# EAGLE schematic circuit_schematic (EAGLE 9.7.0)
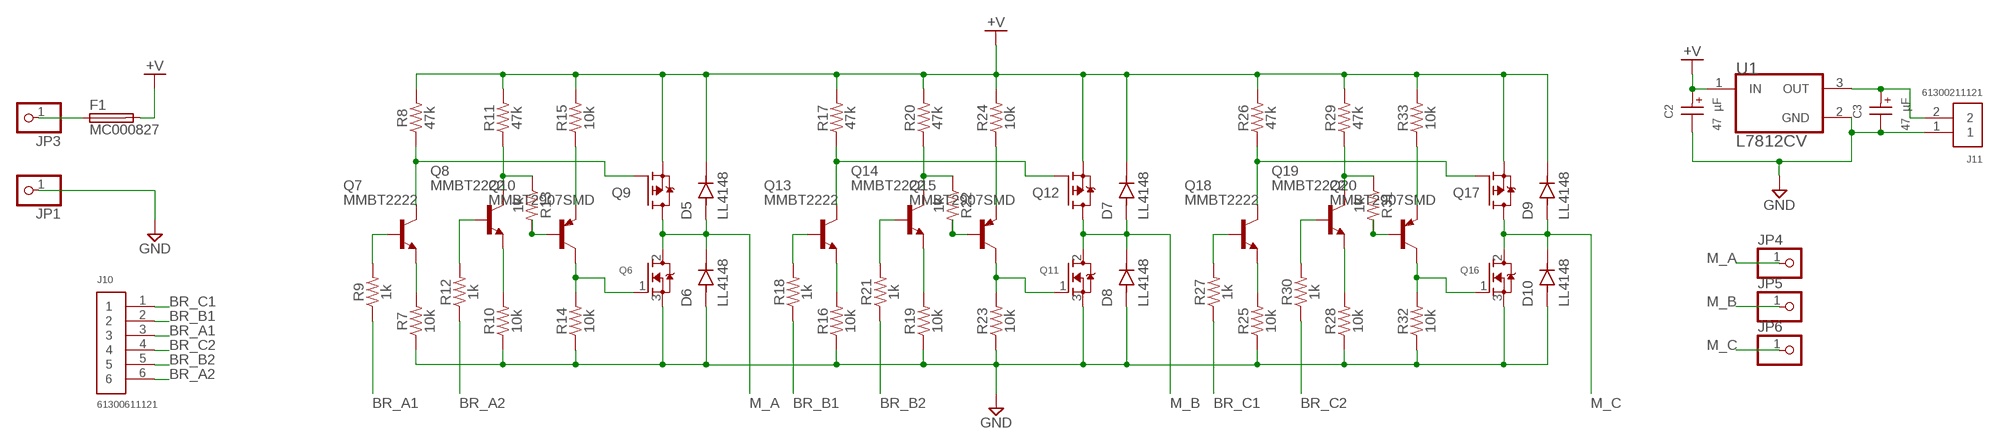
[diagram p0: schematic, sheet 1]

## Parts
C2  47 µF  WCAP-ATET_5X11_860130272001  [WCAP-ATET_5X11(DXL)]
C3  47 µF  WCAP-ATET_5X11_860130272001  [WCAP-ATET_5X11(DXL)]
D5  LL4148  [DIO_LL4148]
D6  LL4148  [DIO_LL4148]
D7  LL4148  [DIO_LL4148]
D8  LL4148  [DIO_LL4148]
D9  LL4148  [DIO_LL4148]
D10  LL4148  [DIO_LL4148]
F1  MC000827  [MC000827]
J10  61300611121  [61300611121]
J11  61300211121  [61300211121]
JP1  PINHD-1X1  [1X01]
JP3  PINHD-1X1  [1X01]
JP4  PINHD-1X1  [1X01]
JP5  PINHD-1X1  [1X01]
JP6  PINHD-1X1  [1X01]
Q6  MOSFET-NGDS_TO220V  [TO220V]
Q7  MMBT2222  [SOT23-BEC]
Q8  MMBT2222  [SOT23-BEC]
Q9  MOSFET-PGDS_TO220V  [TO220V]
Q10  MMBT2907SMD  [SOT23-BEC]
Q11  MOSFET-NGDS_TO220V  [TO220V]
Q12  MOSFET-PGDS_TO220V  [TO220V]
Q13  MMBT2222  [SOT23-BEC]
Q14  MMBT2222  [SOT23-BEC]
Q15  MMBT2907SMD  [SOT23-BEC]
Q16  MOSFET-NGDS_TO220V  [TO220V]
Q17  MOSFET-PGDS_TO220V  [TO220V]
Q18  MMBT2222  [SOT23-BEC]
Q19  MMBT2222  [SOT23-BEC]
Q20  MMBT2907SMD  [SOT23-BEC]
R7  10k  RESISTOR1206  [1206]
R8  47k  RESISTOR1206  [1206]
R9  1k  RESISTOR1206  [1206]
R10  10k  RESISTOR1206  [1206]
R11  47k  RESISTOR1206  [1206]
R12  1k  RESISTOR1206  [1206]
R13  1k  RESISTOR1206  [1206]
R14  10k  RESISTOR1206  [1206]
R15  10k  RESISTOR1206  [1206]
R16  10k  RESISTOR1206  [1206]
R17  47k  RESISTOR1206  [1206]
R18  1k  RESISTOR1206  [1206]
R19  10k  RESISTOR1206  [1206]
R20  47k  RESISTOR1206  [1206]
R21  1k  RESISTOR1206  [1206]
R22  1k  RESISTOR1206  [1206]
R23  10k  RESISTOR1206  [1206]
R24  10k  RESISTOR1206  [1206]
R25  10k  RESISTOR1206  [1206]
R26  47k  RESISTOR1206  [1206]
R27  1k  RESISTOR1206  [1206]
R28  10k  RESISTOR1206  [1206]
R29  47k  RESISTOR1206  [1206]
R30  1k  RESISTOR1206  [1206]
R31  1k  RESISTOR1206  [1206]
R32  10k  RESISTOR1206  [1206]
R33  10k  RESISTOR1206  [1206]
U1  L7812CV  [TO-220-3]

## Nets
+V: C2.1(+) D5.C D7.C D9.C F1.P$2 Q9.3(S) Q12.3(S) Q17.3(S) R8.2 R11.2 R15.2 R17.2 R20.2 R24.2 R26.2 R29.2 R33.2 U1.1(IN)
BR_A1: J10.3 R9.1
BR_A2: J10.6 R12.1
BR_B1: J10.2 R18.1
BR_B2: J10.5 R21.1
BR_C1: J10.1 R27.1
BR_C2: J10.4 R30.1
GND: C2.2(-) C3.2(-) D6.A D8.A D10.A J11.1 JP1.1 Q6.3(S) Q11.3(S) Q16.3(S) R7.1 R10.1 R14.1 R16.1 R19.1 R23.1 R25.1 R28.1 R32.1 U1.2(GND)
M_A: D5.A D6.C JP4.1 Q6.2(D) Q9.2(D)
M_B: D7.A D8.C JP5.1 Q11.2(D) Q12.2(D)
M_C: D9.A D10.C JP6.1 Q16.2(D) Q17.2(D)
N$4: Q8.C R11.1 R13.1
N$10: Q8.B R12.2
N$11: Q8.E R10.2
N$12: Q6.1(G) Q10.C R14.2
N$13: Q10.E R15.1
N$14: Q7.B R9.2
N$15: Q7.C Q9.1(G) R8.1
N$16: Q7.E R7.2
N$19: Q10.B R13.2
N$20: F1.P$1 JP3.1
N$22: Q14.C R20.1 R22.1
N$23: Q14.B R21.2
N$24: Q14.E R19.2
N$25: Q11.1(G) Q15.C R23.2
N$26: Q15.E R24.1
N$27: Q13.B R18.2
N$28: Q12.1(G) Q13.C R17.1
N$29: Q13.E R16.2
N$30: C3.1(+) J11.2 U1.3(OUT)
N$32: Q15.B R22.2
N$36: Q19.C R29.1 R31.1
N$37: Q19.B R30.2
N$38: Q19.E R28.2
N$39: Q16.1(G) Q20.C R32.2
N$40: Q20.E R33.1
N$41: Q18.B R27.2
N$42: Q17.1(G) Q18.C R26.1
N$43: Q18.E R25.2
N$46: Q20.B R31.2

## Library data of the parts
C2 C3 = Wurth_Capacitors_WCAP-ATET:WCAP-ATET_5X11: WCAP-ATET Aluminium Electrolytic Capacitors High Temperature +125 °C Characteristics High operating temperature product series Mounting style: THT Radial Capacitance range: 0.47 µF ‒ 1000 µF Capacitance tolerance: ±20 % Voltage range (UR): 10 ‒ 350 V(DC) Operating temperature: -40 °C up to +125 °C for UR ≤100 V(DC) -25 °C up to +125 °C for UR >100 V(DC) Endurance: 1000 ‒ 2000 h @ +125 °C Dimensions (DxL) in mm: 5.0 x 11.0 up to 16.0 x 31.5 Recommended soldering: Wave soldering Applications High operating temperature applications Filtering Smoothing Energy storage Coupling e.g. Switched-mode power supply, AC/DC converter, adapter, charger, digital camera <https://www.we-online.com/catalog/media/o14728v209%20Family_WCAP-ATET.jpg> Details see: https://www.we-online.com/catalog/en/WCAP-ATET/ Updated by yingchun,Shan;2020-02-28 2020(C) Würth Elektronik; DATASHEET-URL: https://www.we-online.com/catalog/datasheet/860130272001.pdf; DF: 18%; DIAMETER: 5mm; I-LEAK: 4.7uA; I-RIPPLE: 92mA; L: 11mm; OPERATING-TEMPERATURE: -40 °C up to +125 °C; PART-NUMBER: 860130272001; PITCH: 2mm; TECHNICAL-REFERENCE: ATGC110470M010DSPA3A000; VR: 10V(DC)
D5-D10 = LL4148:LL4148: Surface Mount Switching Glass Check availability <https://pricing.snapeda.com/parts/LL4148/MDD/view-part?ref=eda>; AVAILABILITY: In Stock; DESCRIPTION: Diode Standard 75 V 200mA Surface Mount LL-34; MF: MDD; MP: LL4148; PACKAGE: None; PRICE: None; PURCHASE-URL: https://pricing.snapeda.com/search/part/LL4148/?ref=eda
F1 = MC000827:MC000827: Check availability <https://pricing.snapeda.com/parts/MC000827/Multicomp/view-part?ref=eda>; AVAILABILITY: In Stock; DESCRIPTION: Fuse Holder, 250 V, 6.3 A, Pcb Fuse Holder, Through Hole, 1; MF: Multicomp; MP: MC000827; PACKAGE: None; PRICE: None
J10 = Headers:61300611121: CONN HEADER VERT 6POS 2.54MM Manufacturer's datasheet <https://katalog.we-online.de/em/datasheet/6130xx11121.pdf>; CREATED_BY: PCBLayout.com; DIGI_KEY_PART_NUMBER: 732-5319-ND; MANUFACTURER: Wurth Electronics Inc.; MPN: 61300611121
J11 = Headers:61300211121: CONN HEADER VERT 2POS 2.54MM Manufacturer's datasheet <https://katalog.we-online.de/em/datasheet/6130xx11121.pdf>; CREATED_BY: PCBLayout.com; DIGI_KEY_PART_NUMBER: 732-5315-ND; MANUFACTURER: Wurth Electronics Inc.; MPN: 61300211121
JP1 JP3-JP6 = pinhead:PINHD-1X1: PIN HEADER
Q6 Q11 Q16 = adafruit:MOSFET-N: N-Channel Mosfet 2N7002E - 60V 260mA SOT23 [Digikey: 2N7002ET1GOSTR-ND] - REEL BSH103 - 30V 850mA SOT23 [Digikey: 568-5013-1-ND]
Q7 Q8 Q13 Q14 Q18 Q19 = MMBT2222_:MMBT2222*: NPN Transistor Check availability <https://pricing.snapeda.com/parts/MMBT2222/ON%20Semiconductor/view-part?ref=eda>; AVAILABILITY: In Stock; DESCRIPTION: Bipolar (BJT) Transistor NPN 30 V 600 mA 250MHz 300 mW Surface Mount SOT-23-3 (TO-236); MF: ON Semiconductor; MP: MMBT2222; PACKAGE: SOT-23-3 Fairchild Semiconductor; PRICE: None; PURCHASE-URL: https://pricing.snapeda.com/search/part/MMBT2222/?ref=eda
Q9 Q12 Q17 = adafruit:MOSFET-P
Q10 Q15 Q20 = MMBT2907_:MMBT2907*: PNP Transistror Check availability <https://pricing.snapeda.com/parts/MMBT2907/ON%20Semiconductor/view-part?ref=eda>; AVAILABILITY: In Stock; DESCRIPTION: Bipolar (BJT) Transistor PNP 60 V 600 mA 200MHz 150 mW Surface Mount SC-70-3 (SOT323); MF: ON Semiconductor; MP: MMBT2907; PACKAGE: SOT-23-3 ON Semiconductor; PRICE: None; PURCHASE-URL: https://pricing.snapeda.com/search/part/MMBT2907/?ref=eda
R7-R33 = SparkFun-Resistors:RESISTOR: Generic Resistor Package
U1 = L7812CV:L7812CV: IC REG LINEAR 12V 1.5A TO220AB Check availability <https://pricing.snapeda.com/parts/L7812CV/STMicroelectronics/view-part?ref=eda>; AVAILABILITY: In Stock; DESCRIPTION: Linear Voltage Regulator IC Positive Fixed 1 Output 1.5A TO-220; MF: STMicroelectronics; MP: L7812CV; PACKAGE: TO-220 STMicroelectronics; PRICE: None; PURCHASE-URL: https://pricing.snapeda.com/search/part/L7812CV/?ref=eda